# Altium schematic sheet p2_half_bridge.SchDoc
size A1; Organization: Protel International P/L; Address1: L3, 12a Rodborough Rd; Address2: Frenchs Forest; Address3: NSW; Address4: Australia 2086
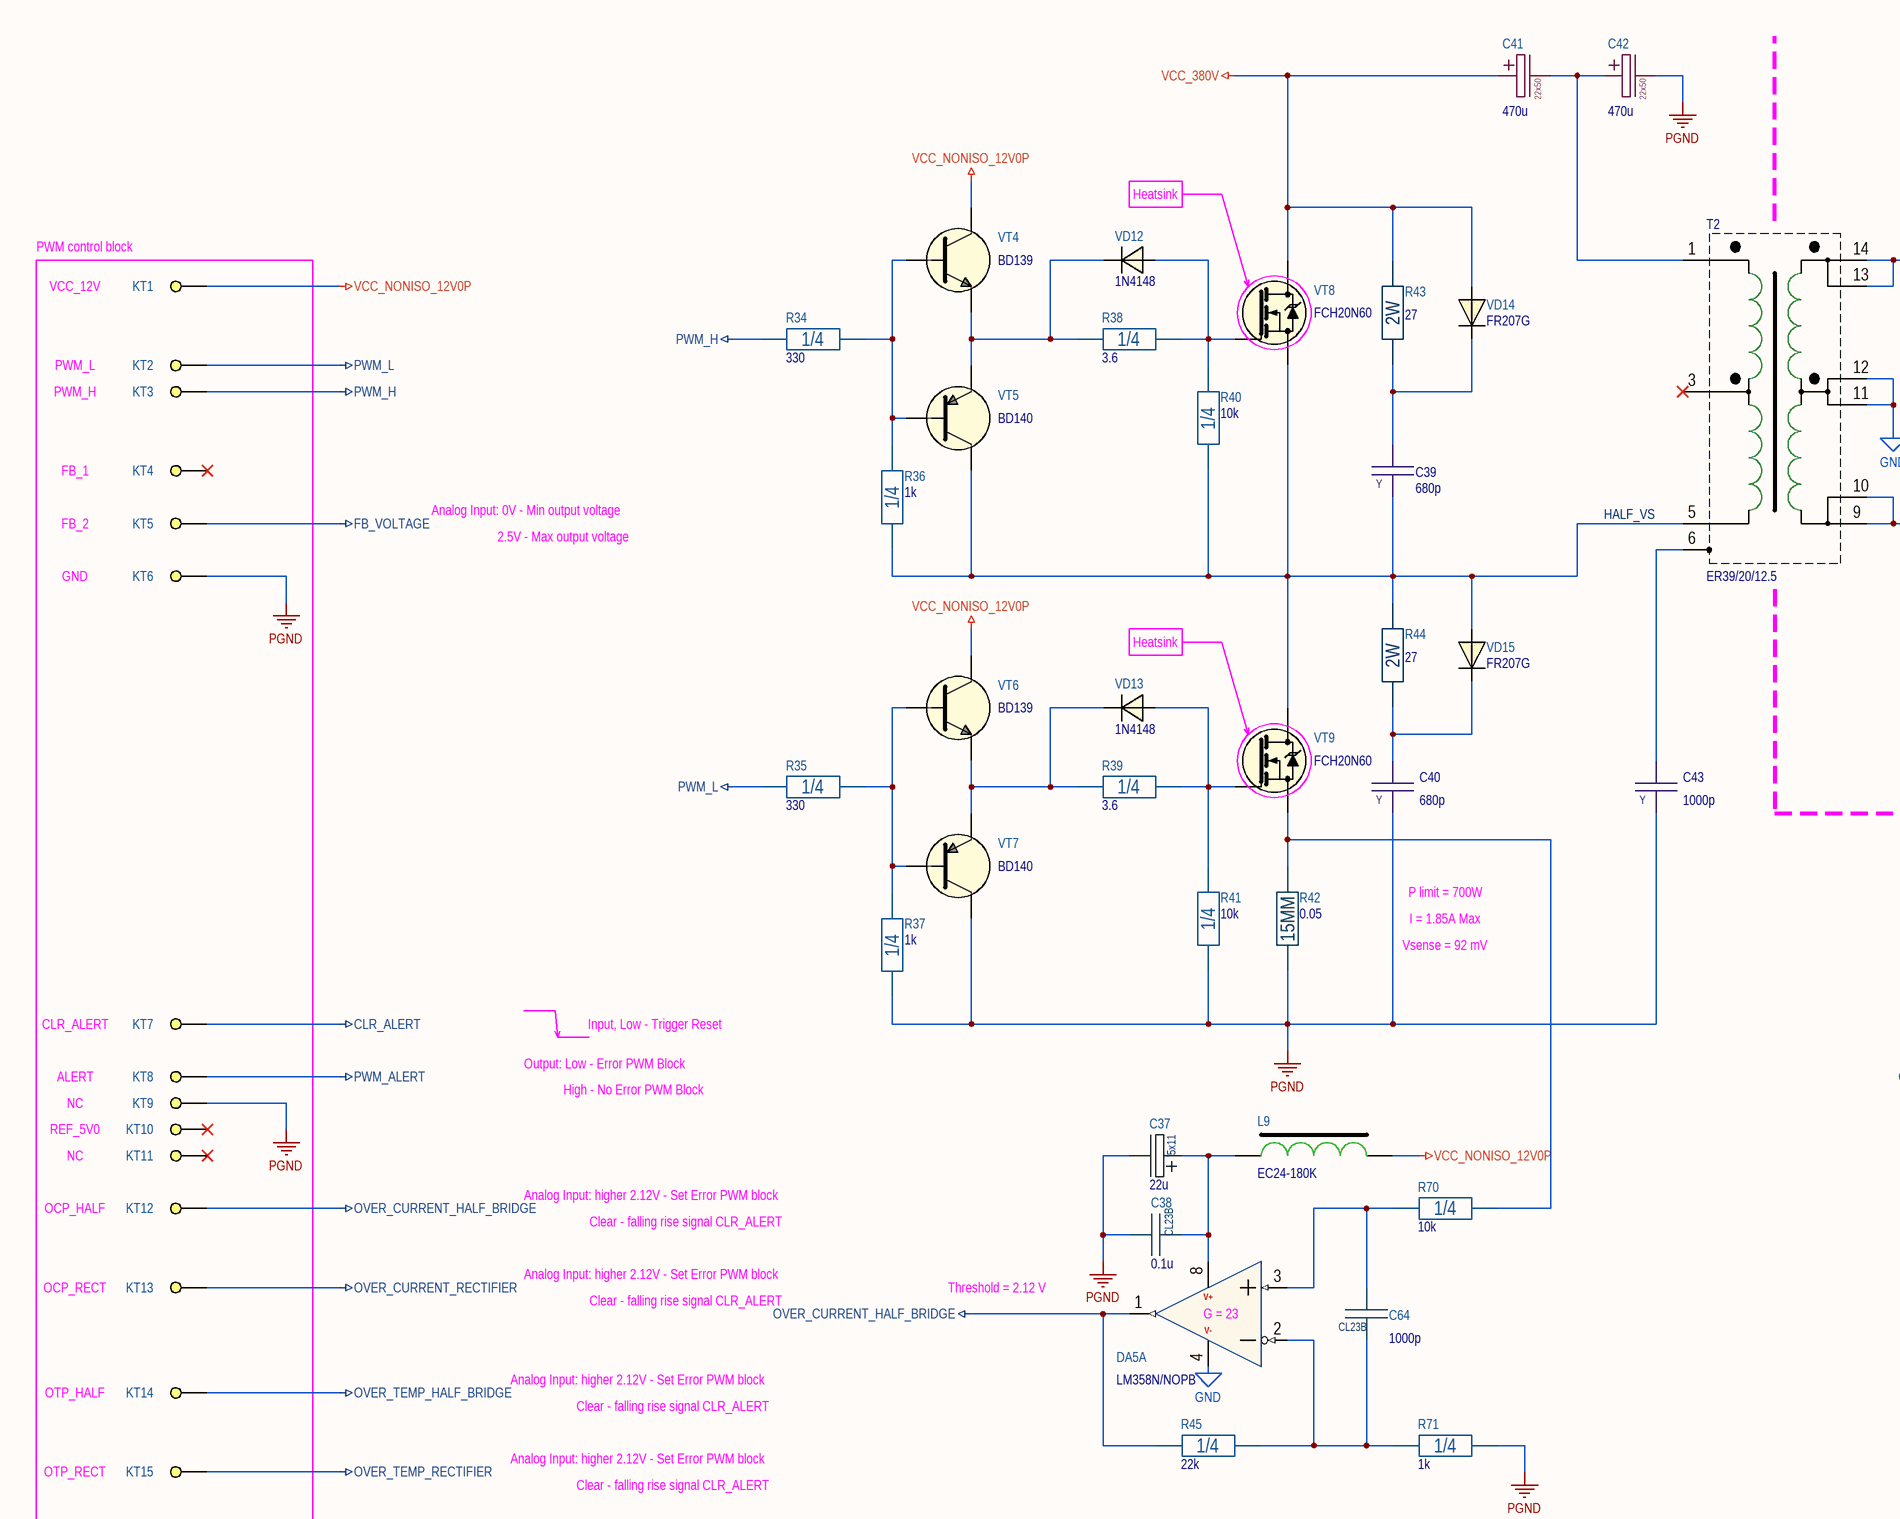
[diagram p0: p2_half_bridge.SchDoc, top left]
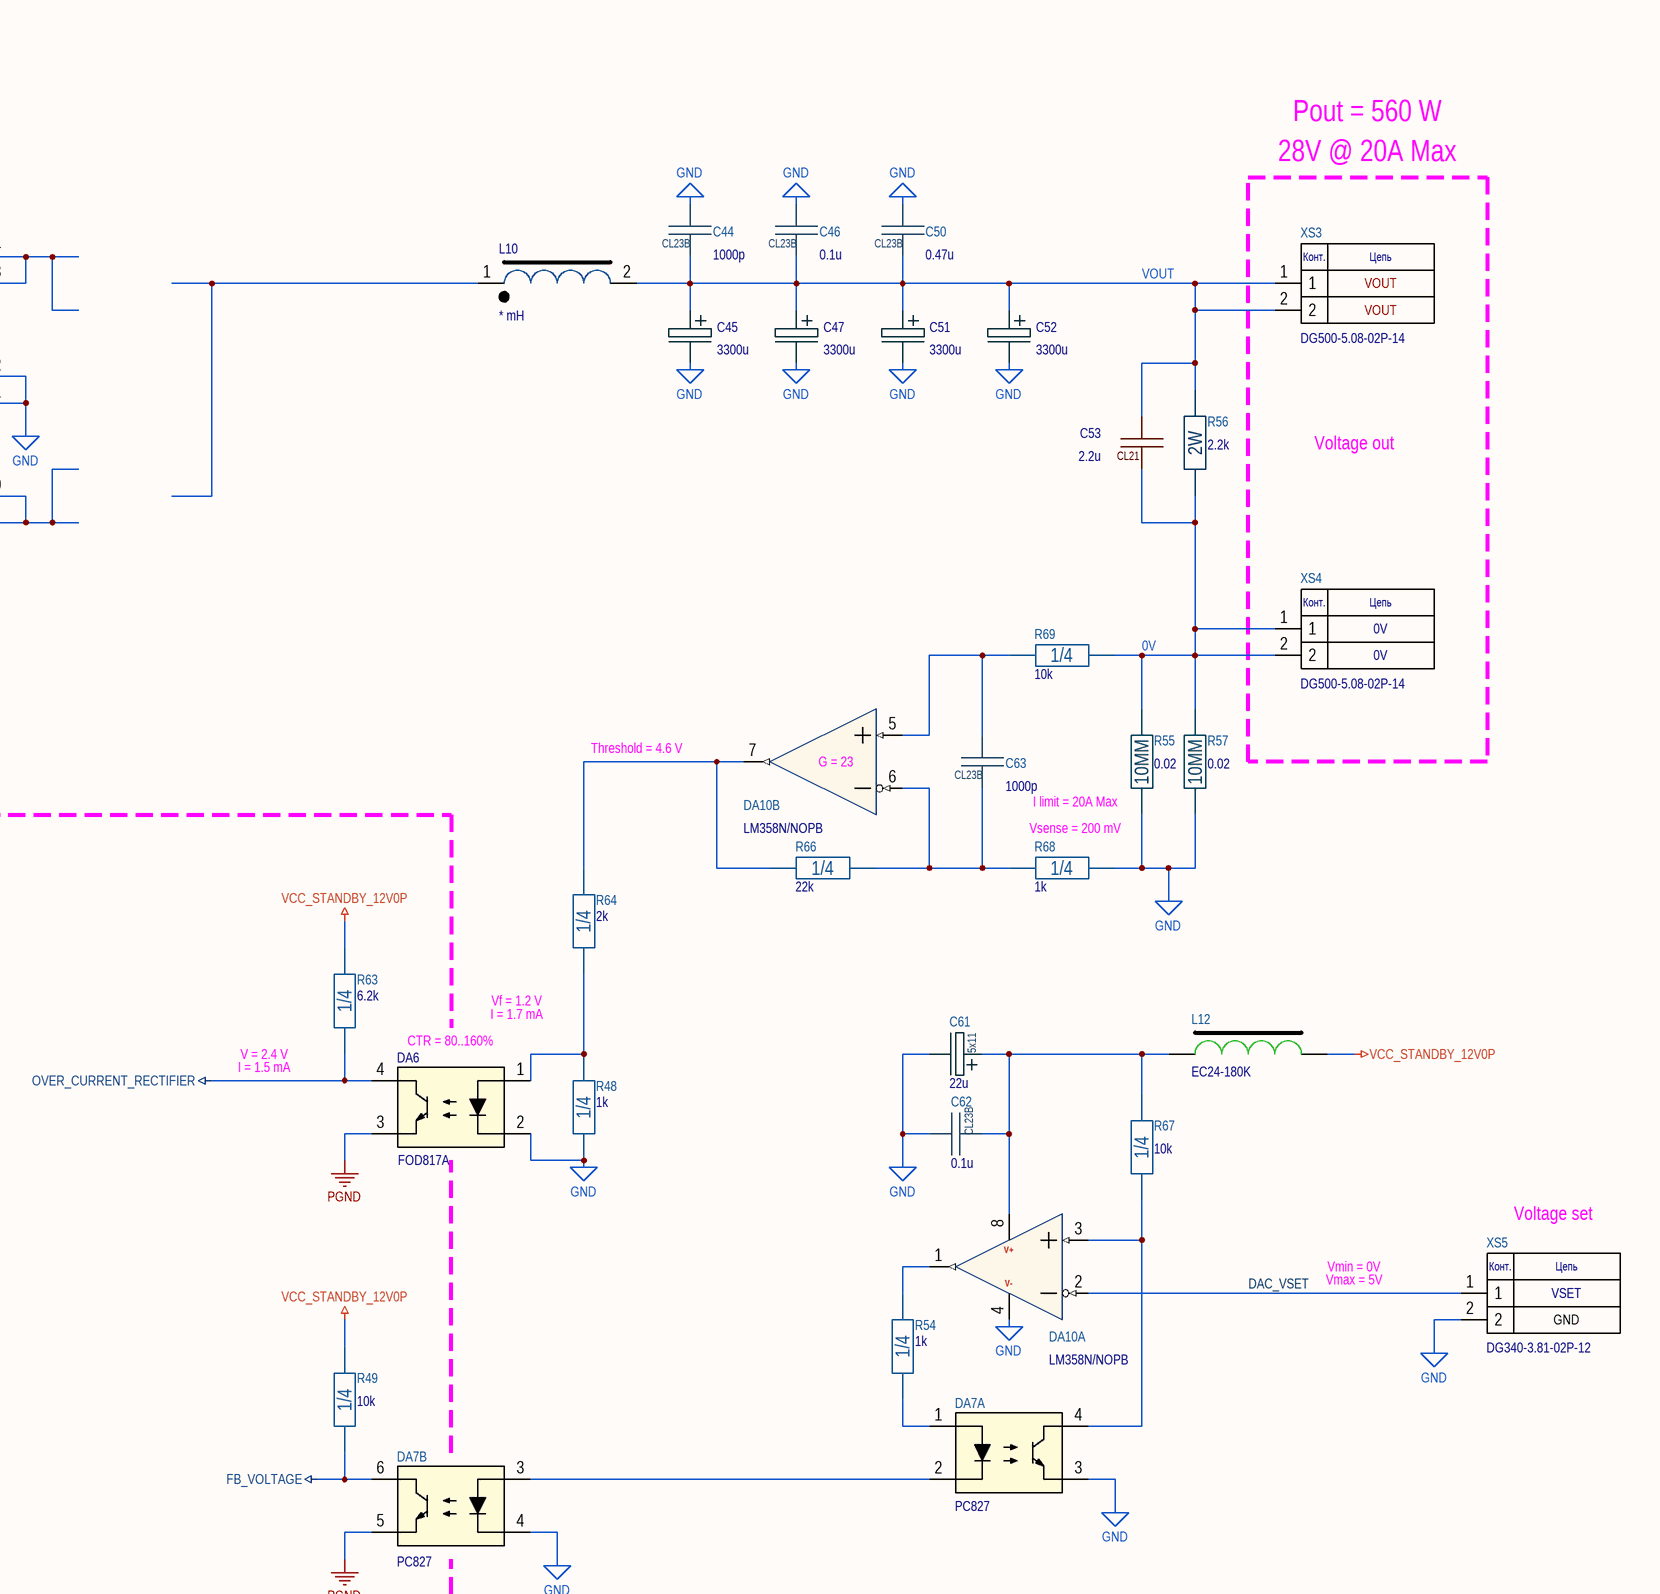
[diagram p1: p2_half_bridge.SchDoc, top right]
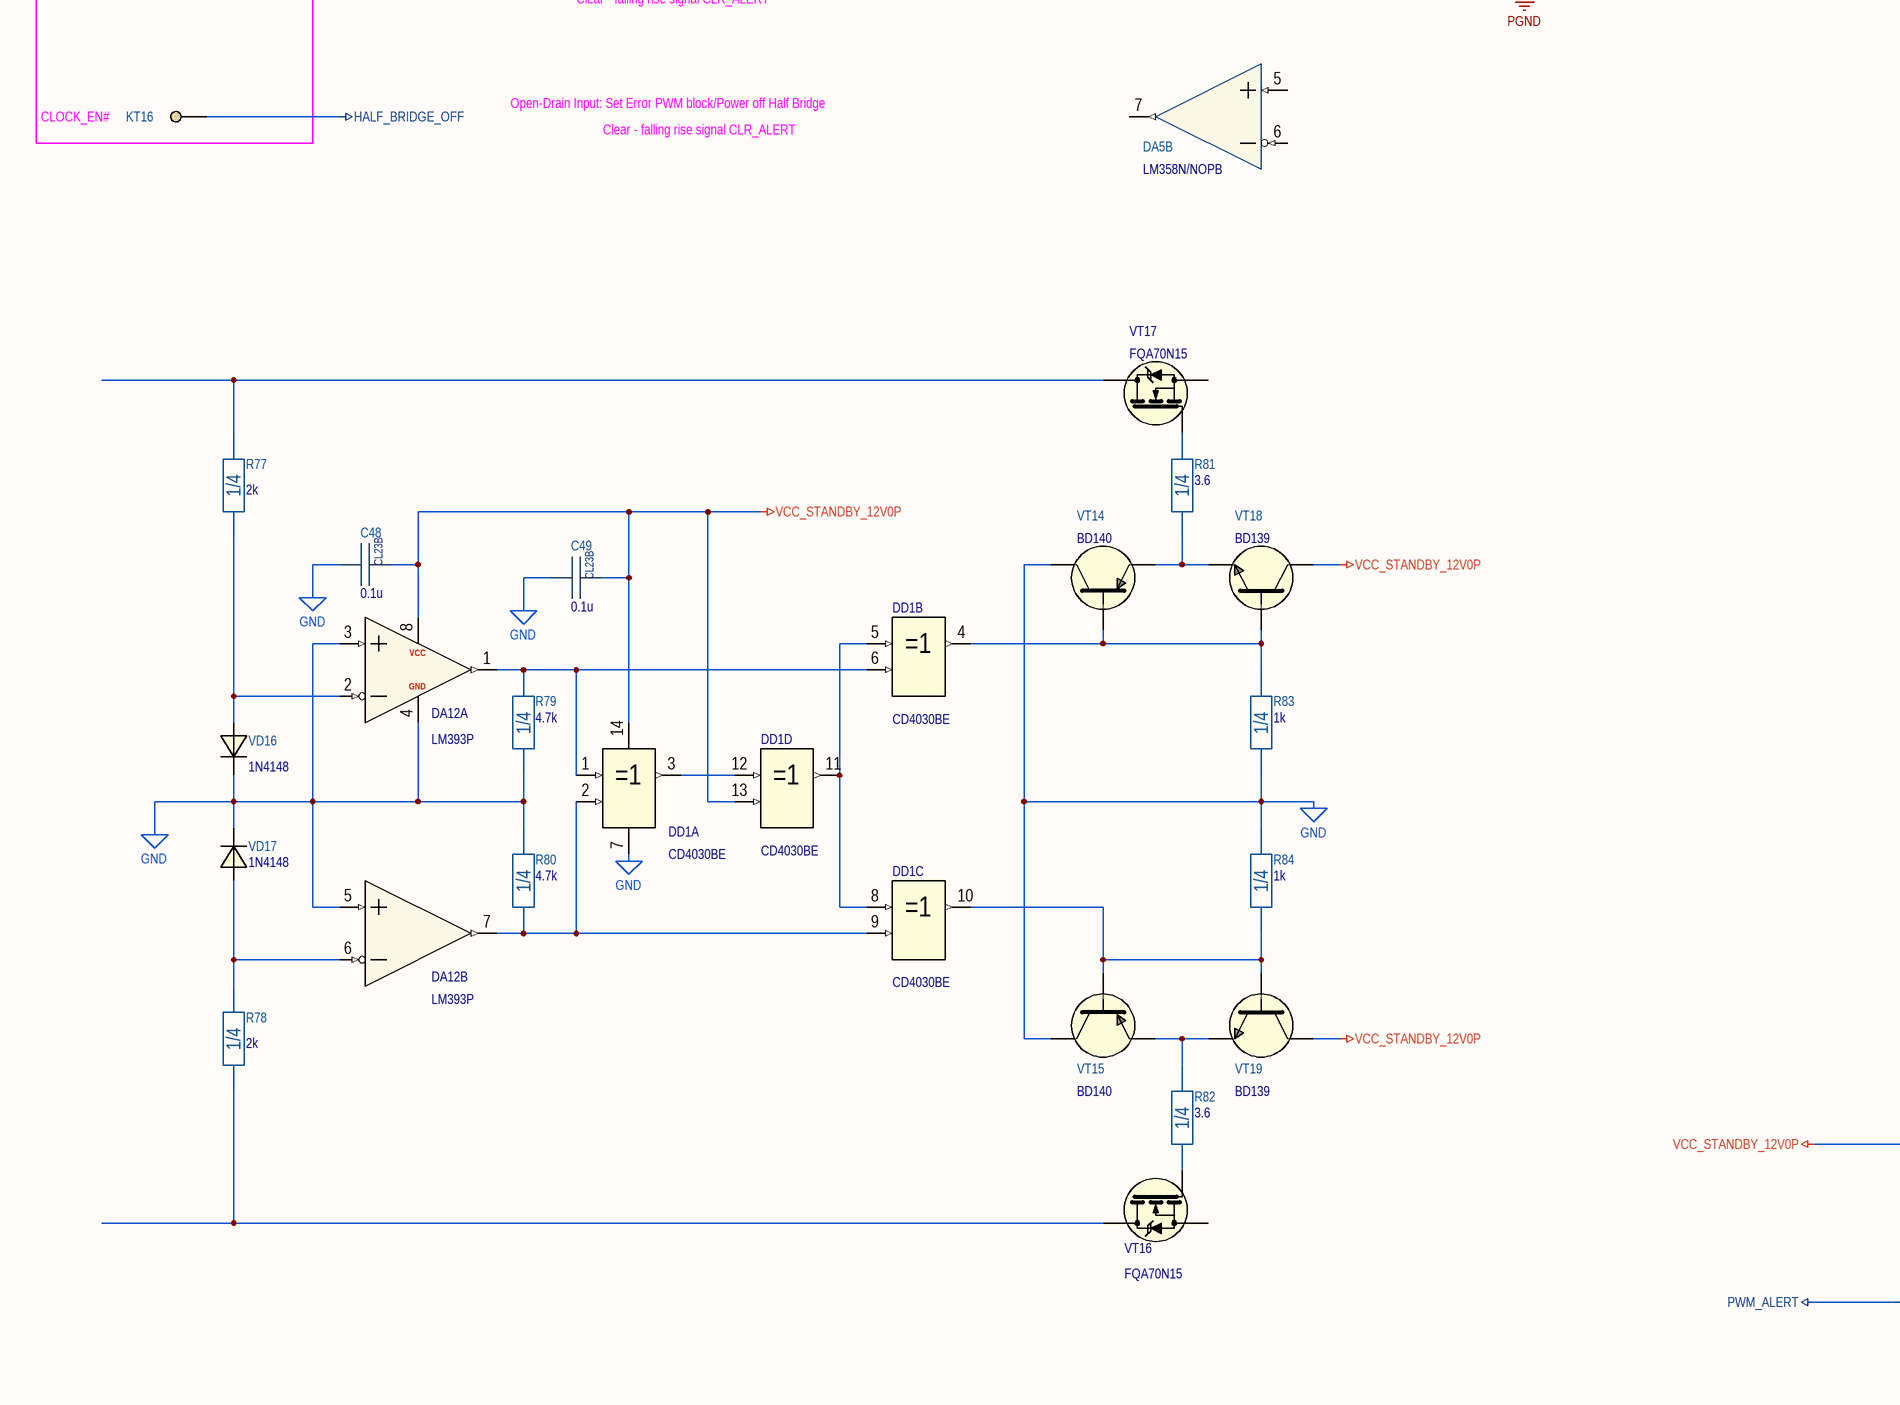
[diagram p2: p2_half_bridge.SchDoc, bottom left]
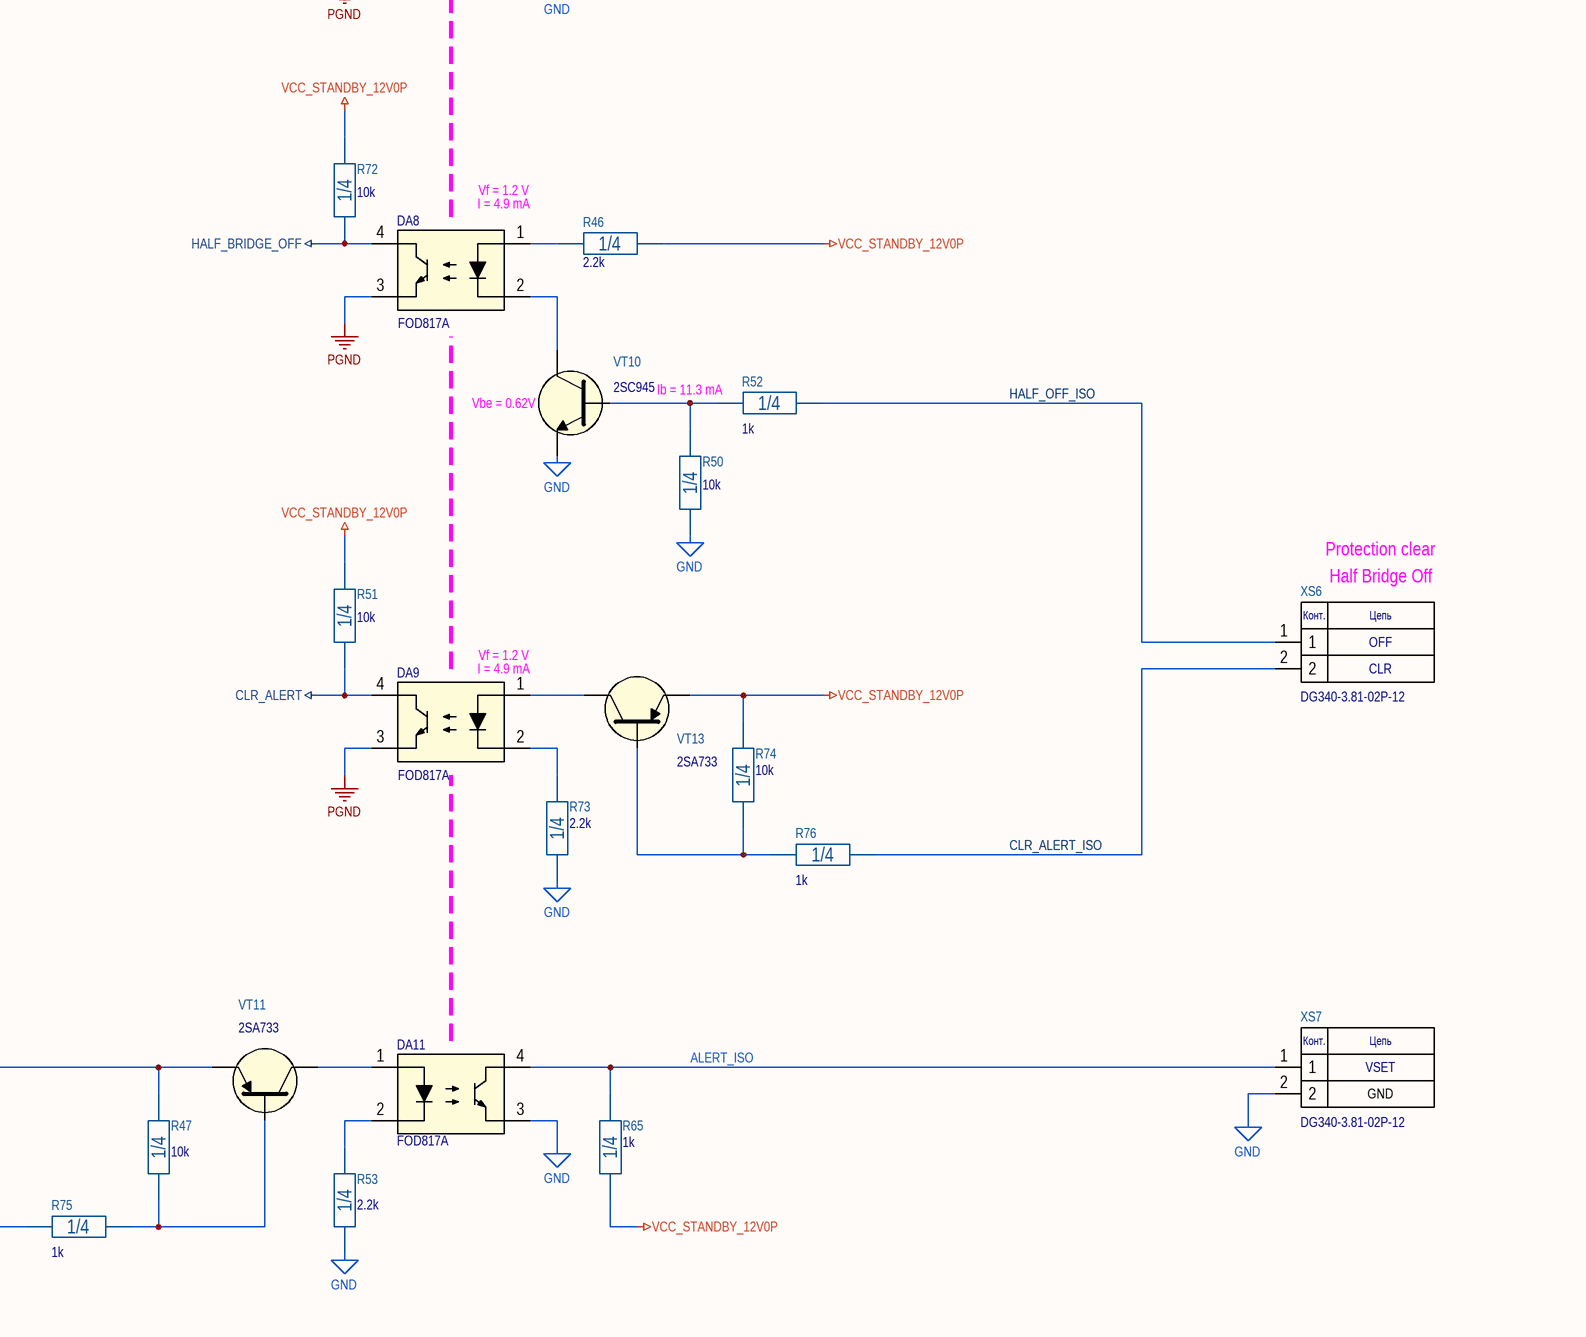
[diagram p3: p2_half_bridge.SchDoc, bottom right]

## Parts
C37  22u  Package: 5x11  [ECAP5X11X2.0_BRW]
C38  0.1u  [CL23B_7.2x2.5]
C39  680p  Package: Y  [JYC_Y2_CAP_7.5]
C40  680p  Package: Y  [JYC_Y2_CAP_7.5]
C41  470u  Package: 22x50  [ECAP22X50X10]
C42  470u  Package: 22x50  [ECAP22X50X10]
C43  1000p  Package: Y  [JYC_Y2_CAP_7.5]
C44  1000p  [CL23B_7.2x2.5]
C45  3300u  [ECAP16X36X75_BLK]
C46  0.1u  [CL23B_7.2x2.5]
C47  3300u  [ECAP16X36X75_BLK]
C48  0.1u  [CL23B_7.2x2.5]
C49  0.1u  [CL23B_7.2x2.5]
C50  0.47u  [CL23B_7.2x3.5]
C51  3300u  [ECAP16X36X75_BLK]
C52  3300u  [ECAP16X36X75_BLK]
C53  2.2u  [CL21_29x24.5x14.0_P27.5]
C61  22u  Package: 5x11  [ECAP5X11X2.0_BRW]
C62  0.1u  [CL23B_7.2x2.5]
C63  1000p  [CL23B_7.2x2.5]
C64  1000p  [CL23B_7.2x2.5]
DA5  LM358N/NOPB  [DIP-8P-M01_with_SO8]  (parts A,B of 2)
DA6  FOD817A  [DIP-4P]
DA7  PC827  [DIP-8P-M01]  (parts A,B of 2)
DA8  FOD817A  [DIP-4P]
DA9  FOD817A  [DIP-4P]
DA10  LM358N/NOPB  [DIP-8P-M01_with_SO8]  (parts A,B of 2)
DA11  FOD817A  [DIP-4P]
DA12  LM393P  [DIP-8P-M01_with_SO8]  (parts A,B of 2)
DD1  CD4030BE  [DIP-14P-M02]  (parts A,B,C,D of 4)
KT1  TEST_PAD  [TEST_PAD_HOLE1.1x1.8SQ]  (value not drawn)  (net tie, no BOM)
KT2  TEST_PAD  [TEST_PAD_HOLE1.1x1.8]  (value not drawn)  (net tie, no BOM)
KT3  TEST_PAD  [TEST_PAD_HOLE1.1x1.8]  (value not drawn)  (net tie, no BOM)
KT4  TEST_PAD  [TEST_PAD_HOLE1.1x1.8]  (value not drawn)  (net tie, no BOM)
KT5  TEST_PAD  [TEST_PAD_HOLE1.1x1.8]  (value not drawn)  (net tie, no BOM)
KT6  TEST_PAD  [TEST_PAD_HOLE1.1x1.8]  (value not drawn)  (net tie, no BOM)
KT7  TEST_PAD  [TEST_PAD_HOLE1.1x1.8]  (value not drawn)  (net tie, no BOM)
KT8  TEST_PAD  [TEST_PAD_HOLE1.1x1.8]  (value not drawn)  (net tie, no BOM)
KT9  TEST_PAD  [TEST_PAD_HOLE1.1x1.8]  (value not drawn)  (net tie, no BOM)
KT10  TEST_PAD  [TEST_PAD_HOLE1.1x1.8]  (value not drawn)  (net tie, no BOM)
KT11  TEST_PAD  [TEST_PAD_HOLE1.1x1.8]  (value not drawn)  (net tie, no BOM)
KT12  TEST_PAD  [TEST_PAD_HOLE1.1x1.8]  (value not drawn)  (net tie, no BOM)
KT13  TEST_PAD  [TEST_PAD_HOLE1.1x1.8]  (value not drawn)  (net tie, no BOM)
KT14  TEST_PAD  [TEST_PAD_HOLE1.1x1.8]  (value not drawn)  (net tie, no BOM)
KT15  TEST_PAD  [TEST_PAD_HOLE1.1x1.8]  (value not drawn)  (net tie, no BOM)
KT16  TEST_PAD  [TEST_PAD_HOLE1.1x1.8]  (value not drawn)  (net tie, no BOM)
L9  EC24-180K  [EC24_GREEN]
L10  * mH  [CORE_D33_GB]
L12  EC24-180K  [EC24_GREEN]
R34  330  Package: 1/4  [CFR-25(VERTICAL)]
R35  330  Package: 1/4  [CFR-25(VERTICAL)]
R36  1k  Package: 1/4  [CFR-25(VERTICAL)]
R37  1k  Package: 1/4  [CFR-25(VERTICAL)]
R38  3.6  Package: 1/4  [CFR-25(VERTICAL)]
R39  3.6  Package: 1/4  [CFR-25(VERTICAL)]
R40  10k  Package: 1/4  [CFR-25(VERTICAL)]
R41  10k  Package: 1/4  [CFR-25(VERTICAL)]
R42  0.05  Package: 15MM  [CURRENT_SENSE_15x18mm]
R43  27  Package: 2W  [CFR-200(VERTICAL)]
R44  27  Package: 2W  [CFR-200(VERTICAL)]
R45  22k  Package: 1/4  [CFR-25]
R46  2.2k  Package: 1/4  [CFR-25]
R47  10k  Package: 1/4  [CFR-25]
R48  1k  Package: 1/4  [CFR-25]
R49  10k  Package: 1/4  [CFR-25]
R50  10k  Package: 1/4  [CFR-25]
R51  10k  Package: 1/4  [CFR-25]
R52  1k  Package: 1/4  [CFR-25]
R53  2.2k  Package: 1/4  [CFR-25]
R54  1k  Package: 1/4  [CFR-25]
R55  0.02  Package: 10MM  [CURRENT_SENSE_10x11mm]
R56  2.2k  Package: 2W  [CFR-200(VERTICAL)]
R57  0.02  Package: 10MM  [CURRENT_SENSE_10x11mm]
R63  6.2k  Package: 1/4  [CFR-25]
R64  2k  Package: 1/4  [CFR-25]
R65  1k  Package: 1/4  [CFR-25]
R66  22k  Package: 1/4  [CFR-25]
R67  10k  Package: 1/4  [CFR-25]
R68  1k  Package: 1/4  [CFR-25]
R69  10k  Package: 1/4  [CFR-25]
R70  10k  Package: 1/4  [CFR-25]
R71  1k  Package: 1/4  [CFR-25]
R72  10k  Package: 1/4  [CFR-25]
R73  2.2k  Package: 1/4  [CFR-25]
R74  10k  Package: 1/4  [CFR-25]
R75  1k  Package: 1/4  [CFR-25]
R76  1k  Package: 1/4  [CFR-25]
R77  2k  Package: 1/4  [CFR-25]
R78  2k  Package: 1/4  [CFR-25]
R79  4.7k  Package: 1/4  [CFR-25]
R80  4.7k  Package: 1/4  [CFR-25]
R81  3.6  Package: 1/4  [CFR-25(VERTICAL)]
R82  3.6  Package: 1/4  [CFR-25(VERTICAL)]
R83  1k  Package: 1/4  [CFR-25(VERTICAL)]
R84  1k  Package: 1/4  [CFR-25(VERTICAL)]
T2  ER39/20/12.5  [ER39/20/12.5]
VD12  1N4148  [DO-35 GLASS LIGHT RED]
VD13  1N4148  [DO-35 GLASS LIGHT RED]
VD14  FR207G  [DO-15]
VD15  FR207G  [DO-15]
VD16  1N4148  [DO-35 GLASS LIGHT RED]
VD17  1N4148  [DO-35 GLASS LIGHT RED]
VT4  BD139  [TO-126 (VERTICAL)]
VT5  BD140  [TO-126 (VERTICAL)]
VT6  BD139  [TO-126 (VERTICAL)]
VT7  BD140  [TO-126 (VERTICAL)]
VT8  FCH20N60  [TO-247_with_TO-220 (VERTICAL)]
VT9  FCH20N60  [TO-247_with_TO-220 (VERTICAL)]
VT10  2SC945  [TO-92 (VERTICAL,LINE)]
VT11  2SA733  [TO-92 (VERTICAL,LINE)]
VT13  2SA733  [TO-92 (VERTICAL,LINE)]
VT14  BD140  [TO-126 (VERTICAL)]
VT15  BD140  [TO-126 (VERTICAL)]
VT16  FQA70N15  [TO-3PN (VERTICAL)]
VT17  FQA70N15  [TO-3PN (VERTICAL)]
VT18  BD139  [TO-126 (VERTICAL)]
VT19  BD139  [TO-126 (VERTICAL)]
XS3  DG500-5.08-02P-14  [DG500-5.08-02P]
XS4  DG500-5.08-02P-14  [DG500-5.08-02P]
XS5  DG340-3.81-02P-12  [DG340-3.81-02P]
XS6  DG340-3.81-02P-12  [DG340-3.81-02P]
XS7  DG340-3.81-02P-12  [DG340-3.81-02P]

## Blocks framed on the sheet
Voltage out: XS3 XS4

## Nets
CLR_ALERT: DA9.4(COLLECTOR) KT7.1 R51.2
FB_VOLTAGE: DA7.6(COLLECTOR2) KT5.1 R49.2
GND: C44.1 C45.2 C46.1 C47.2 C48.2 C49.2 C50.1 C51.2 C52.2 C61.2 C62.2 DA5.4(V-) DA6.2(CATHODE) DA7.3(EMITTER1) DA7.4(CATHODE2) DA10.4(V-) DA11.3(EMITTER) DA12.3(1IN+) DA12.4(GND) DA12.5(2IN+) DD1.7(GND) R48.1 R50.2 R53.1 R55.1 R57.1 R68.1 R73.1 R79.1 R80.2 R83.1 R84.1 T2.11 T2.12 VD16.1 VD17.1 VT10.3(E) VT14.2(C) VT15.2(C) XS5.2 XS7.2
HALF_BRIDGE_OFF: DA8.4(COLLECTOR) KT16.1 R72.2
OVER_CURRENT_HALF_BRIDGE: DA5.1(1OUT) KT12.1 R45.2
OVER_CURRENT_RECTIFIER: DA6.4(COLLECTOR) KT13.1 R63.2
OVER_TEMP_HALF_BRIDGE: KT14.1
OVER_TEMP_RECTIFIER: KT15.1
PGND: C37.2 C38.2 C40.1 C42.2 C43.1 DA6.3(EMITTER) DA7.5(EMITTER2) DA8.3(EMITTER) DA9.3(EMITTER) KT6.1 KT9.1 R37.1 R41.1 R42.1 R71.1 VT7.2(C)
PWM_ALERT: KT8.1 R75.1
PWM_H: KT3.1 R34.2
PWM_L: KT2.1 R35.2
VCC_380V: C41.1 R43.2 VD14.2(A) VT8.2(D)
VCC_NONISO_12V0P: KT1.1 L9.2 VT4.2(C) VT6.2(C)
VCC_STANDBY_12V0P: C48.1 C49.1 DA12.8(VCC) DD1.13(B3) DD1.14(VCC) L12.2 R46.1 R47.2 R49.1 R51.1 R63.1 R65.1 R72.1 R74.2 VT11.3(E) VT13.3(E) VT18.2(C) VT19.2(C)
0V: C53.1 R55.2 R56.1 R57.2 R69.2 XS4.1 XS4.2
ALERT_ISO: DA11.4(COLLECTOR) R65.2 XS7.1
CLR_ALERT_ISO: R76.2 XS6.2
DAC_VSET: DA10.2(1IN-) XS5.1
HALF_OFF_ISO: R52.2 XS6.1
HALF_VS: C39.1 R36.1 R40.1 R44.2 T2.5 VD15.2(A) VT5.2(C) VT8.3(S) VT9.2(D)
VOUT: C44.2 C45.1 C46.2 C47.1 C50.2 C51.1 C52.1 C53.2 L10.2 R56.2 XS3.1 XS3.2
NetC37_1: C37.1 C38.1 DA5.8(V+) L9.1
NetC39_2: C39.2 R43.1 VD14.1(C)
NetC40_2: C40.2 R44.1 VD15.1(C)
NetC41_2: C41.2 C42.1 T2.1
NetC43_2: C43.2 T2.6
NetC61_1: C61.1 C62.1 DA10.8(V+) L12.1 R67.1
NetC63_1: C63.1 DA10.5(2IN+) R69.1
NetC63_2: C63.2 DA10.6(2IN-) R66.1 R68.2
NetC64_1: C64.1 DA5.3(1IN+) R70.1
NetC64_2: C64.2 DA5.2(1IN-) R45.1 R71.2
NetDA6_1: DA6.1(ANODE) R48.2 R64.1
NetDA7_1: DA7.1(ANODE1) R54.1
NetDA7_2: DA7.2(CATHODE1) DA7.3(ANODE2)
NetDA7_4: DA7.4(COLLECTOR1) DA10.3(1IN+) R67.2
NetDA8_1: DA8.1(ANODE) R46.2
NetDA8_2: DA8.2(CATHODE) VT10.2(C)
NetDA9_1: DA9.1(ANODE) VT13.2(C)
NetDA9_2: DA9.2(CATHODE) R73.2
NetDA10_1: DA10.1(1OUT) R54.2
NetDA10_7: DA10.7(2OUT) R64.2 R66.2
NetDA11_1: DA11.1(ANODE) VT11.2(C)
NetDA11_2: DA11.2(CATHODE) R53.2
NetDA12_1: DA12.1(1OUT) DD1.1(A0) DD1.6(B1) R79.2
NetDA12_2: DA12.2(1IN-) R77.1 VD16.2
NetDA12_6: DA12.6(2IN-) R78.2 VD17.2
NetDA12_7: DA12.7(2OUT) DD1.2(B0) DD1.9(B2) R80.1
NetDD1_3: DD1.3(Y0) DD1.12(A3)
NetDD1_4: DD1.4(Y1) R83.2 VT14.1(B) VT18.1(B)
NetDD1_5: DD1.5(A1) DD1.8(A2) DD1.11(Y3)
NetDD1_10: DD1.10(Y2) R84.2 VT15.1(B) VT19.1(B)
NetR34_1: R34.1 R36.2 VT4.1(B) VT5.1(B)
NetR35_1: R35.1 R37.2 VT6.1(B) VT7.1(B)
NetR38_1: R38.1 R40.2 VD12.2 VT8.1(G)
NetR38_2: R38.2 VD12.1 VT4.3(E) VT5.3(E)
NetR39_1: R39.1 R41.2 VD13.2 VT9.1(G)
NetR39_2: R39.2 VD13.1 VT6.3(E) VT7.3(E)
NetR42_2: R42.2 R70.2 VT9.3(S)
NetR47_1: R47.1 R75.2 VT11.1(B)
NetR50_1: R50.1 R52.1 VT10.1(B)
NetR74_1: R74.1 R76.1 VT13.1(B)
NetR77_2: R77.2 VT17.2(D)
NetR78_1: R78.1 VT16.2(D)
NetR81_1: R81.1 VT17.1(G)
NetR81_2: R81.2 VT14.3(E) VT18.3(E)
NetR82_1: R82.1 VT16.1(G)
NetR82_2: R82.2 VT15.3(E) VT19.3(E)
NetT2_9: T2.9 T2.10
NetT2_13: T2.13 T2.14

Not connected (* = marked no-connect by the designer): DA5 5(2IN+) 6(2IN-) 7(2OUT); KT4 1*; KT10 1*; KT11 1*; L10 1; T2 3*; VT16 3(S); VT17 3(S)

## Notes on the sheet
- Pout = 560 W
- Heatsink
- 28V @ 20A Max
- (near KT1) PWM control block
- VCC_12V
- VOUT
- PWM_L
- PWM_H
- FB_1
- FB_2
- Analog Input: 0V - Min output voltage
- 2.5V - Max output voltage
- GND
- 0V
- Threshold = 4.6 V
- (near DA10) G = 23
- (near R55) I limit = 20A Max
- Vsense = 200 mV
- I = 1.85A Max
- P limit = 700W
- Vsense = 92 mV
- Vf = 1.2 V
- I = 1.7 mA
- ALERT
- CLR_ALERT
- Output: Low - Error PWM Block
- Input, Low - Trigger Reset
- (near R63) V = 2.4 V
- (near R63) I = 1.5 mA
- (near DA6) CTR = 80..160%
- REF_5V0
- NC
- High - No Error PWM Block
- OCP_HALF
- Analog Input: higher 2.12V - Set Error PWM block
- Voltage set
- Clear - falling rise signal CLR_ALERT
- Vmin = 0V
- Vmax = 5V
- OCP_RECT
- Threshold = 2.12 V
- (near DA5) G = 23
- VSET
- OTP_HALF
- OTP_RECT
- CLOCK_EN#
- Open-Drain Input: Set Error PWM block/Power off Half Bridge
- (near DA8) I = 4.9 mA
- (near VT10) Vbe = 0.62V
- (near R52) Ib = 11.3 mA
- Protection clear
- Half Bridge Off
- OFF
- (near DA9) Vf = 1.2 V
- (near DA9) I = 4.9 mA
- CLR
- Title
- Size:
- Date:
- File:
- A1
- Number:
- Time:
- Revision:
- Sheet
- of
- (in symbol DG340-3.81-02P-12) Конт.; Цепь
- (in symbol DG500-5.08-02P-14) Конт.; Цепь

## Library data of the parts
C37 C61 = C_ECAP: Aluminium capacitor; Part Number: UVR1J220MDD; Manufacturer: Nichicon; Tolerance: ± 20 %; Voltage: 63V; Value: 22u; Value on schem: 22u
C38 C44 C46 C48-C50 C62-C64 = CL23B: Box-type metallized polyester film capacitor; Tolerance: ± * %; Voltage: 63V; Dielectric: Polyester; Part Number: *; Manufacturer: *; Package: CL23B
  C38 C46 C48 C49 C62: Value: 0.1u; Value on schem: 0.1u
  C44 C63 C64: Value: 1000p; Value on schem: 1000p
  C50: Value: 0.47u; Value on schem: 0.47u
C39 C40 = JB_Y2: High Voltage Ceramic Capacitor; Part Number: JYC3D681KBB; Manufacturer: JB; Tolerance: ± 10 %; Dielectric: Y5P; Voltage: 2000V; Value: 680p; Value on schem: 680p
C41 C42 = ECAP_22x50: Aluminium capacitors 35x50mm; Part Number: UPW2D471MRD; Manufacturer: Nichicon; Tolerance: ± 20 %; Voltage: 200V; Value: 470u; Value on schem: 470u
C43 = JB_Y2: High Voltage Ceramic Capacitor; Part Number: JYC3D102MBE; Manufacturer: JB; Tolerance: ± 20 %; Dielectric: Y5U; Voltage: 2000V; Value: 1000p; Value on schem: 1000p
C45 C47 C51 C52 = C_ECAP: Aluminium capacitor; Part Number: RD1H338M1635MPA; Manufacturer: Samwha; Tolerance: ± 20 %; Voltage: 50V; Value: 3300u; Value on schem: 3300u; Package: 16x36
C53 = CL21: CL21 Type Metallized Polyester Film Capacitor; Tolerance: ± * %; Voltage: 250V; Value: 2.2u; Dielectric: Polyester; Value on schem: 2.2u; Part Number: *; Manufacturer: *; Package: CL21
DA5 DA10 = LM358N/NOPB: Low-Power, Dual-Operational Amplifiers; Manufacturer: Texas Instruments; Part Number: LM358N/NOPB; Package: DIP-8
DA6 DA8 DA9 DA11 = FOD817A: 5kV Phototransistor Optocoupler; Manufacturer: ON Semiconductor; Package: DIP-4; Part Number: FOD817A
DA7 = PC827: High Density Mounting Type / Photocoupler; Manufacturer: Sharp; Package: DIP-8; Part Number: PC827
DA12 = LM393P: Dual Comparator; Manufacturer: Texas Instruments; Part Number: LM393P; Package: DIP-8
DD1 = CD4030BE: Quad XOR-Gate; Manufacturer: Texas Instruments; Part Number: CD4030BE; Package: DIP-14
KT1-KT16 = TEST_PAD: Test pad
L9 L12 = EC24: Axial leaded coated inductors; Manufacturer: 3L Electronic; RDC: 1 Ohm; SRF Min: 15 MHz; Q: 40; Irms  Max: 315 mA; Inductance @ 100 kHz: 18 µH; Part Number: EC24-180K; Package: EC24
L10 = CORE_D33: Ferrite Core D32.8/20.1/10.7 mm; Core: D33; Value: * mH
R34 R35 = CF25: Resistor 1/4W; Part Number: MFR-25FTF52-330R; Manufacturer: Yageo; Tolerance: ± 1 %; Voltage: 250V; Temperature Coefficient: ±100 ppm/°C; Value: 330; Value on schem: 330
R36 R37 R48 R52 R54 R65 R68 R71 R75 R76 R83 R84 = CF25: Resistor 1/4W; Part Number: MFR-25FTF52-1K; Manufacturer: Yageo; Tolerance: ± 1 %; Voltage: 250V; Temperature Coefficient: ±100 ppm/°C; Value: 1k; Value on schem: 1k
R38 R39 R81 R82 = CF25: Resistor 1/4W; Part Number: MFR-25FTF52-3R6; Manufacturer: Yageo; Tolerance: ± 1 %; Voltage: 250V; Temperature Coefficient: ±100 ppm/°C; Value: 3.6; Value on schem: 3.6
R40 R41 R47 R49-R51 R67 R69 R70 R72 R74 = CF25: Resistor 1/4W; Part Number: MFR-25FTF52-10K; Manufacturer: Yageo; Tolerance: ± 1 %; Voltage: 250V; Temperature Coefficient: ±100 ppm/°C; Value: 10k; Value on schem: 10k
R42 = SHUNT_15MM: Constantan shunt resistor, pitch = 15mm; Tolerance: ±  %; Temperature Coefficient: ±*/°C; Value: 0.05; Value on schem: 0.05; Part Number: *; Manufacturer: *; Voltage: *
R43 R44 = CF200: Resistor 2W; Part Number: KNP200JB-73-27R; Manufacturer: Yageo; Tolerance: ± 5 %; Voltage: 250V; Temperature Coefficient: ±300 ppm/°C; Value: 27; Value on schem: 27
R45 R66 = CF25: Resistor 1/4W; Part Number: MFR-25FTF52-22K; Manufacturer: Yageo; Tolerance: ± 1 %; Voltage: 250V; Temperature Coefficient: ±100 ppm/°C; Value: 22k; Value on schem: 22k
R46 R53 R73 = CF25: Resistor 1/4W; Part Number: MFR-25FTF52-2K2; Manufacturer: Yageo; Tolerance: ± 1 %; Voltage: 250V; Temperature Coefficient: ±100 ppm/°C; Value: 2.2k; Value on schem: 2.2k
R55 R57 = SHUNT_10MM: Constantan shunt resistor, pitch = 10mm; Tolerance: ± 5 %; Temperature Coefficient: ±*/°C; Value: 0.02; Value on schem: 0.02; Part Number: *; Manufacturer: *; Voltage: *
R56 = CF200: Resistor 2W; Part Number: KNP200JB-73-2K2; Manufacturer: Yageo; Tolerance: ± 5 %; Voltage: 250V; Temperature Coefficient: ±300 ppm/°C; Value: 2.2k; Value on schem: 2.2k
R63 = CF25: Resistor 1/4W; Part Number: MFR-25FTF52-5.1K; Manufacturer: Yageo; Tolerance: ± 1 %; Voltage: 250V; Temperature Coefficient: ±100 ppm/°C; Value: 6.2k; Value on schem: 6.2k
R64 R77 R78 = CF25: Resistor 1/4W; Part Number: MFR-25FTF52-2K; Manufacturer: Yageo; Tolerance: ± 1 %; Voltage: 250V; Temperature Coefficient: ±100 ppm/°C; Value: 2k; Value on schem: 2k
R79 R80 = CF25: Resistor 1/4W; Part Number: MFR-25FTF52-4K7; Manufacturer: Yageo; Tolerance: ± 1 %; Voltage: 250V; Temperature Coefficient: ±100 ppm/°C; Value: 4.7k; Value on schem: 4.7k
T2 = ER39: EE39 Ferrite Core, with footprint for ER35, EE33, EI33 etc.; Value: ER39/20/12.5
VD12 VD13 VD16 VD17 = 1N4148: High-speed diode; Package: DO-35; Part Number: 1N4148
VD14 VD15 = FR207G: Diode 2A, 1000V Glass Passivated Fast Recovery Rectifiers; Manufacturer: Taiwan Semiconductor Corporation; Package: DO-15; Part Number: FR207G
VT4 VT6 VT18 VT19 = BD139: General Purpose n-p-n Transistors; Manufacturer: STMicroelectronics; Package: TO-126; Part Number: BD139
VT5 VT7 VT14 VT15 = BD140: General Purpose p-n-p Transistors; Manufacturer: STMicroelectronics; Package: TO-126; Part Number: BD140
VT8 VT9 = FCH20N60: 600V @ 20A N-Channel MOSFET; Manufacturer: ON Semiconductor; Part Number: FCH20N60; Package: TO-247
VT10 = 2SC945: General Purpose n-p-n Transistors; Manufacturer: NEC; Package: TO-92; Part Number: 2SC945
VT11 VT13 = 2SA733: General Purpose p-n-p Transistors; Manufacturer: NEC; Package: TO-92; Part Number: 2SA733
VT16 VT17 = FQA70N15: 150V @ 70A 28 mΩ N-Channel MOSFET; Manufacturer: ON Semiconductor; Part Number: FQA70N15; Package: TO-3PN
XS3 XS4 = DG500-5.08-02P-14: 2-way screw terminal, pitch 200mils (5.08mm); Manufacturer: DEGSON; Part Number: DG500-5.08-02P-14
XS5-XS7 = DG340-3.81-02P-12: 2-way screw terminal, pitch 150mils (3.81mm); Manufacturer: DEGSON; Part Number: DG340-3.81-02P-12